# EAGLE board LH_010 (EAGLE 7.3.0), part 1 of 5
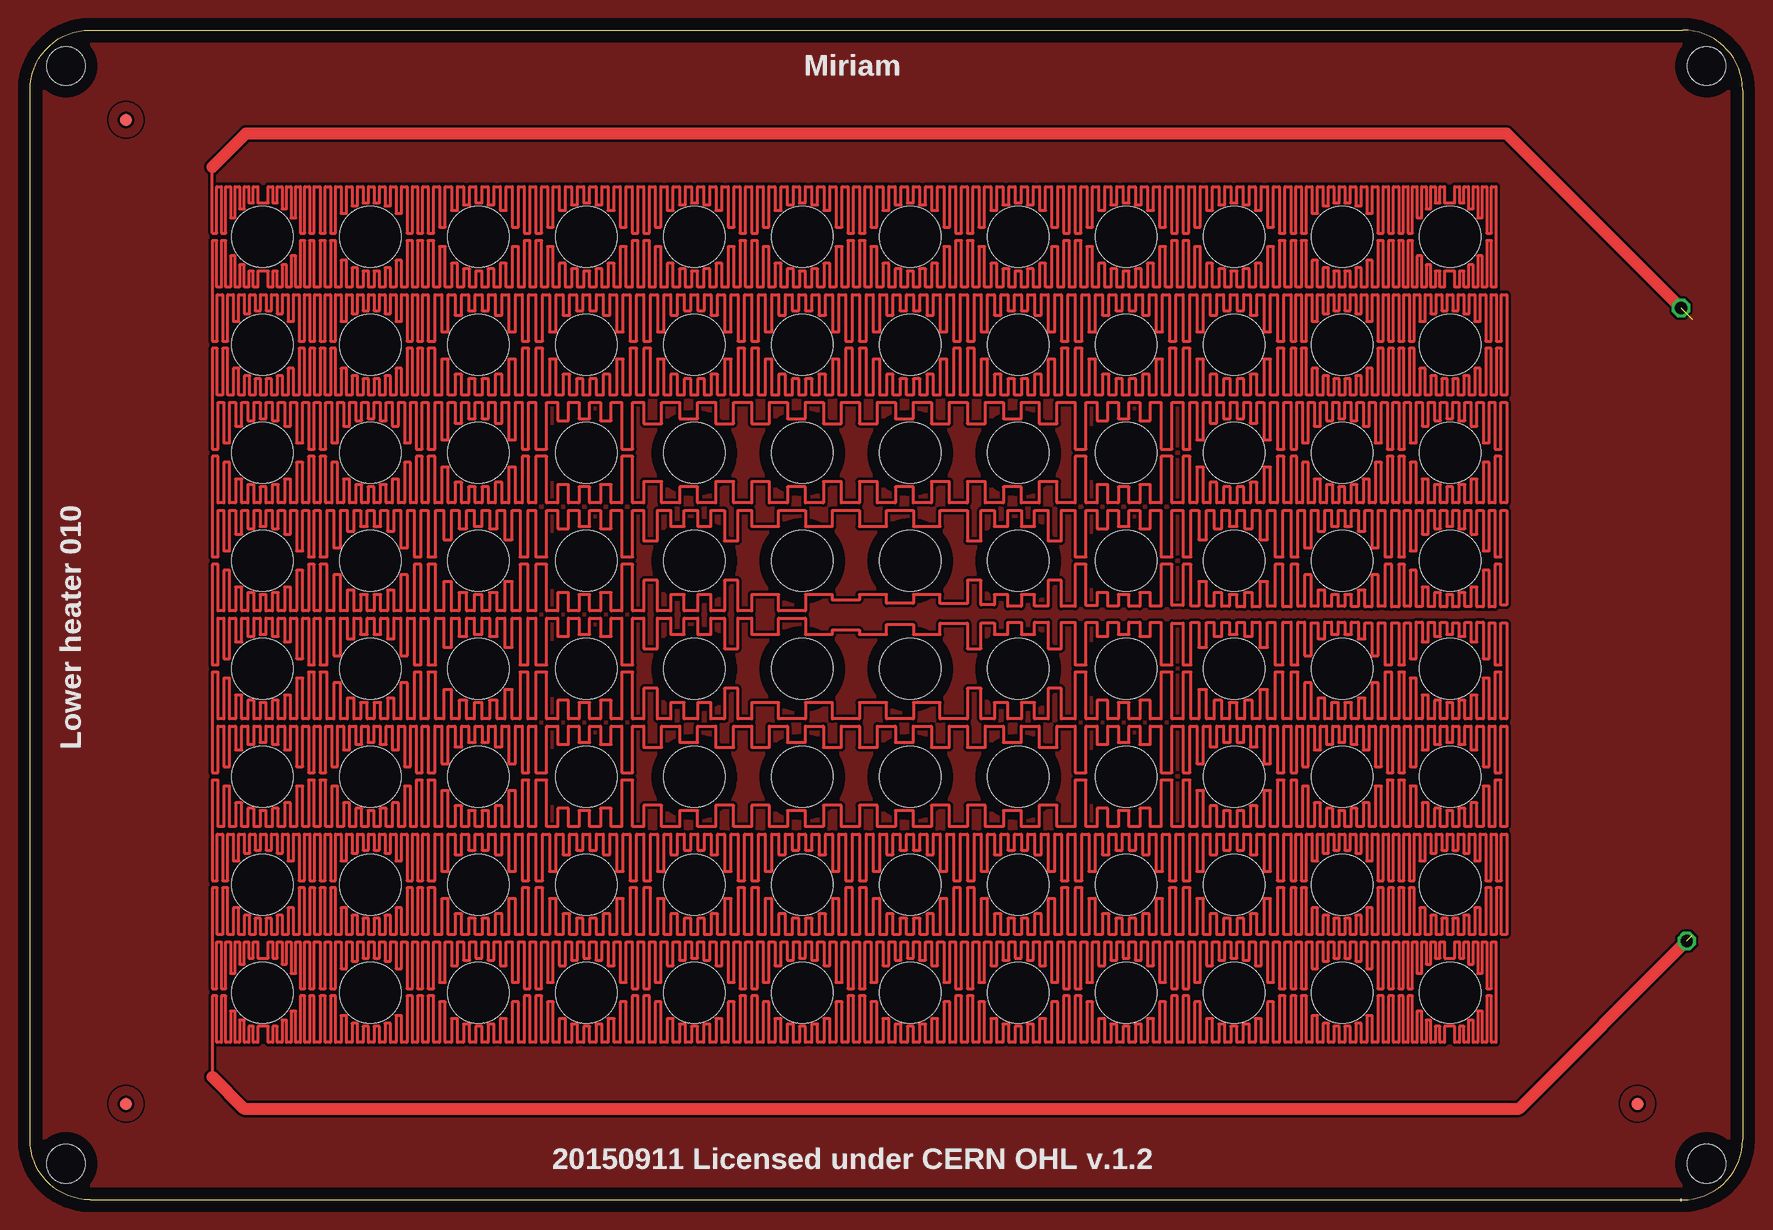
[diagram p1: board, top side]
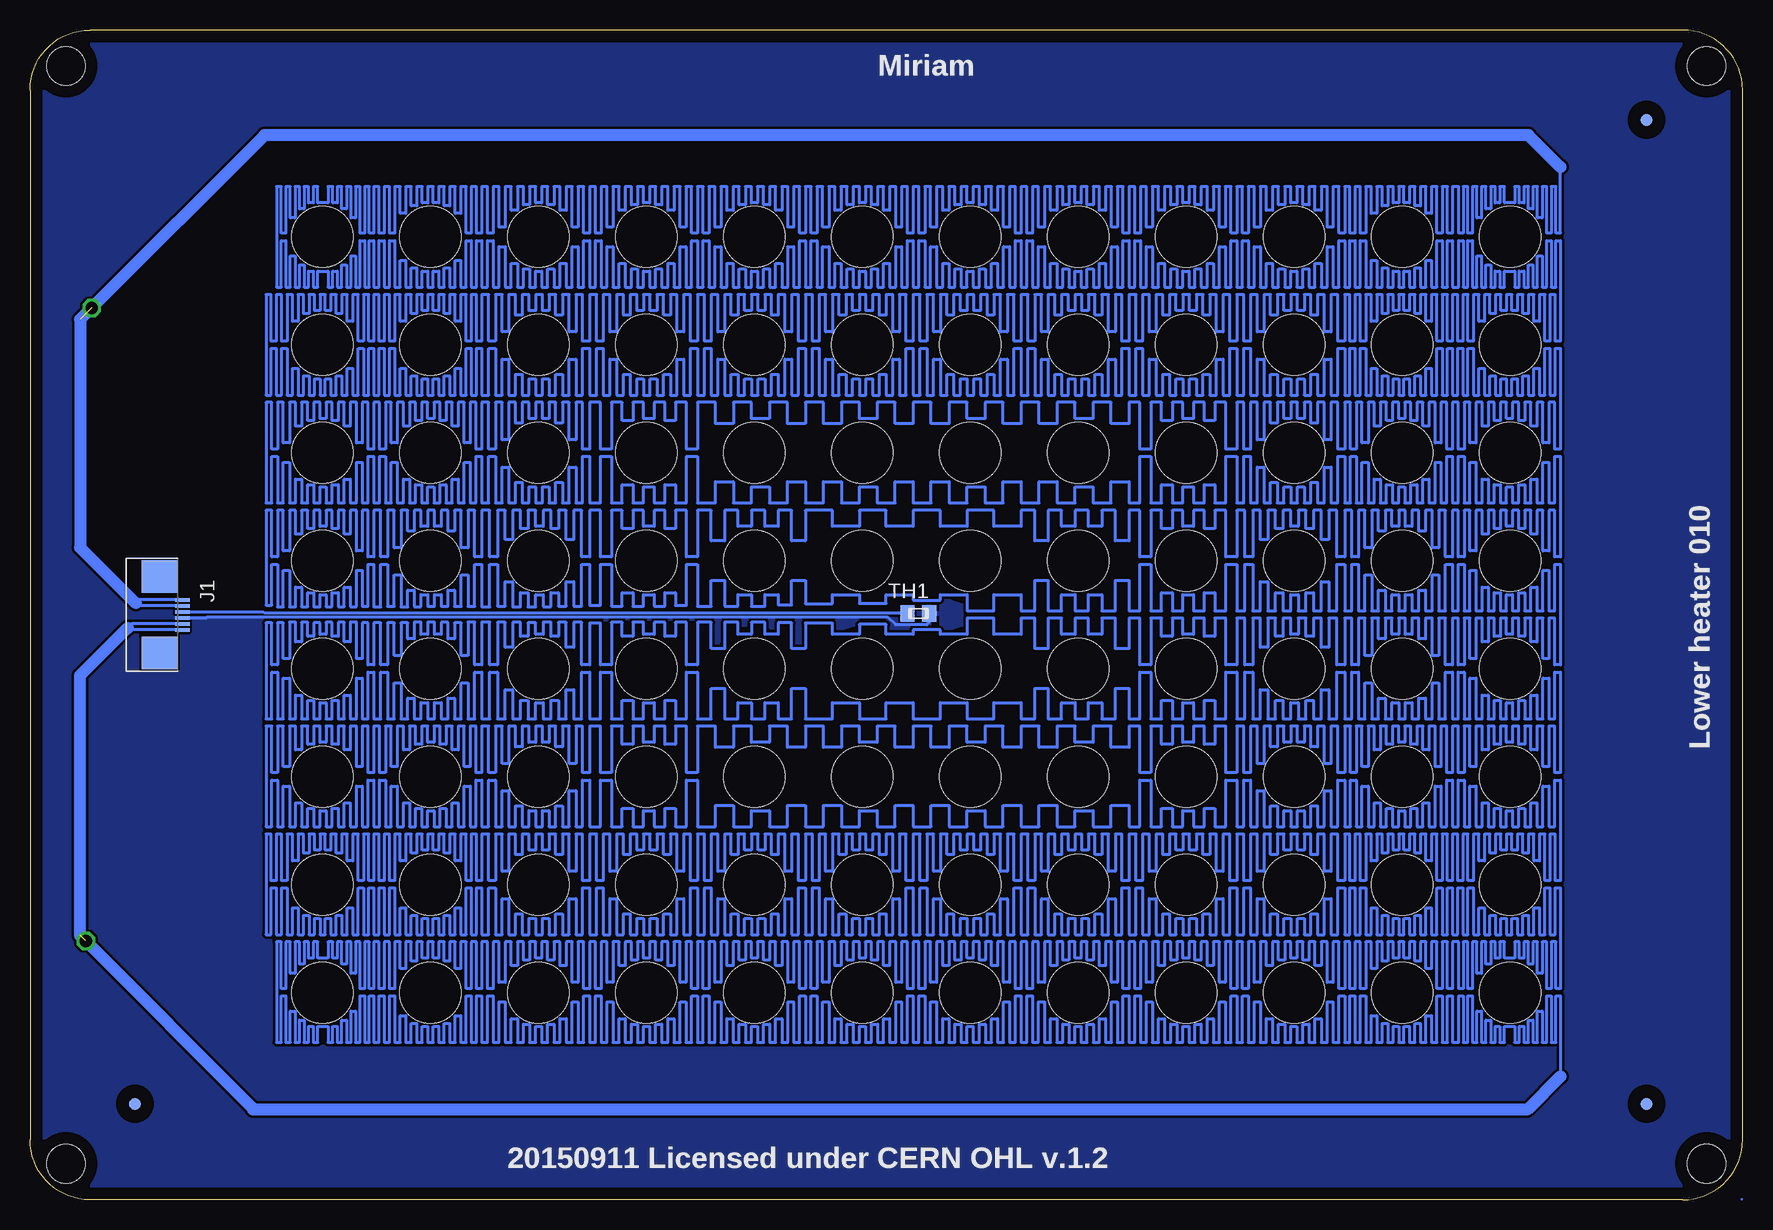
[diagram p2: board, bottom side, seen from below]

Size 142.76 x 97.48 mm. Coordinates in mm from the lower left corner, seen from the top.
Outline: 5,0 137.76,0 arc90 142.76,5 142.76,92.48 arc90 137.76,97.48 5,97.48 arc90 0,92.48 0,5 arc90 5,0
Copper layers (1*16): Top 0.035mm / dielectric 1.5mm / Bottom 0.035mm
Design rules "default": minimum track width 10mil, minimum drill 24mil, track to track 8mil, track to pad 8mil, pad to pad 8mil, via to via 8mil, smd to smd 8mil, copper to edge 40mil, drill to drill 8mil, minimum pad ring 10mil, minimum via ring 8mil, stop-mask expansion 4mil, vias tented up to drill 0mil, thermal gap 10mil
Net classes: 0 default: width 0.254 mm, drill 0.406 mm, clearance 0.178 mm; 1 power: width 0.254 mm, drill 0.406 mm, clearance 0.178 mm; 2 gnd: width 0.254 mm, drill 0.406 mm, clearance 0.178 mm; 3 power usb: width 0.254 mm, drill 0.406 mm, clearance 0.178 mm
Holes 5.08 mm at 19.38,17.24 19.38,26.24 19.38,35.24 19.38,44.24 19.38,53.24 19.38,62.24 19.38,71.24 19.38,80.24 28.38,17.24 28.38,26.24 28.38,35.24 28.38,44.24 28.38,53.24 28.38,62.24 28.38,71.24 28.38,80.24 37.38,17.24 37.38,26.24 37.38,35.24 37.38,44.24 37.38,53.24 37.38,62.24 37.38,71.24 37.38,80.24 46.38,17.24 46.38,26.24 46.38,35.24 46.38,44.24 46.38,53.24 46.38,62.24 46.38,71.24 46.38,80.24 55.38,17.24 55.38,26.24 55.38,35.24 55.38,44.24 55.38,53.24 55.38,62.24 55.38,71.24 55.38,80.24 64.38,17.24 64.38,26.24 64.38,35.24 64.38,44.24 64.38,53.24 64.38,62.24 64.38,71.24 64.38,80.24 73.38,17.24 73.38,26.24 73.38,35.24 73.38,44.24 73.38,53.24 73.38,62.24 73.38,71.24 73.38,80.24 82.38,17.24 82.38,26.24 82.38,35.24 82.38,44.24 82.38,53.24 82.38,62.24 82.38,71.24 82.38,80.24 91.38,17.24 91.38,26.24 91.38,35.24 91.38,44.24 91.38,53.24 91.38,62.24 91.38,71.24 91.38,80.24 100.38,17.24 100.38,26.24 100.38,35.24 100.38,44.24 100.38,53.24 100.38,62.24 100.38,71.24 100.38,80.24 109.38,17.24 109.38,26.24 109.38,35.24 109.38,44.24 109.38,53.24 109.38,62.24 109.38,71.24 109.38,80.24 118.38,17.24 118.38,26.24 118.38,35.24 118.38,44.24 118.38,53.24 118.38,62.24 118.38,71.24 118.38,80.24
Holes 3.2 mm at 3,94.48 139.76,94.48 139.76,3 3,3

## Footprints (pad centres in the part's own frame; a part is rotated, then mirrored left to right if it is on the bottom)
FIDUCIA-MOUNT = smd 1.016 x 1.016: P$1 0,0
68710614522 = smd 0.3 x 1.2: 1 -1.25,1.9; 2 -0.75,1.9; 3 -0.25,1.9; 4 0.25,1.9; 5 0.75,1.9; 6 1.25,1.9 | smd 2.7 x 3: Z1 -3.18,0; Z2 3.18,0
THERMISTOR_SMD_0603 = smd 1.181 x 1.378: 1 -0.9,0; 2 0.9,0

## Placement (x,y rotation side)
FD1  FIDUCIALMOUNT  [FIDUCIA-MOUNT]  134,8 0 top
FD2  FIDUCIALMOUNT  [FIDUCIA-MOUNT]  8,8 0 top
FD3  FIDUCIALMOUNT  [FIDUCIA-MOUNT]  8,90 0 top
FD4  FIDUCIALMOUNT  [FIDUCIA-MOUNT]  134,8 0 bottom
FD5  FIDUCIALMOUNT  [FIDUCIA-MOUNT]  8,8 0 bottom
FD6  FIDUCIALMOUNT  [FIDUCIA-MOUNT]  8,90 0 bottom
J1  [68710614522]  131.95,48.74 270 bottom
TH1  10K  [THERMISTOR_SMD_0603]  68.7,48.85 0 bottom

## Tracks (layer width: path | path; a pad name or v marks a point on that pad's centre or on a via)
+12V  (via drill 1.02)  (3 unrouted)